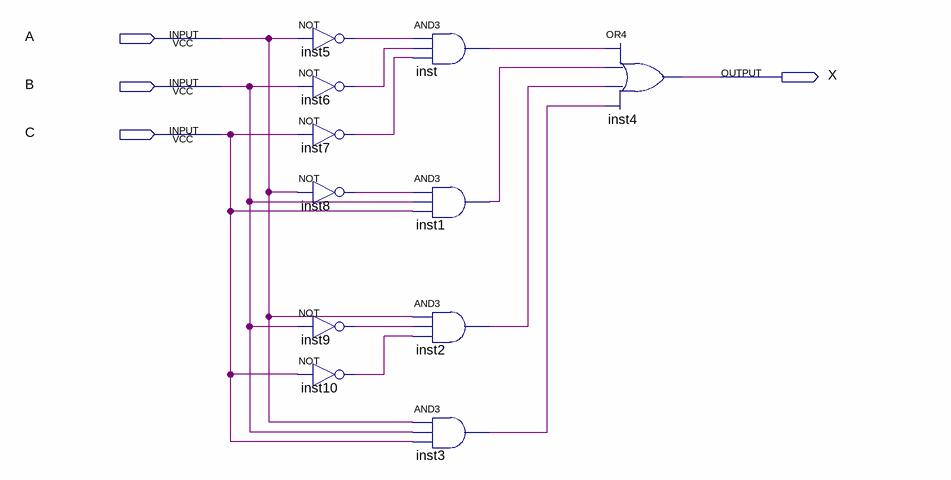
[diagram p0: schematic sheet]
// Quartus schematic CLC.bdf as structural Verilog: 11 symbols, 4 pins
module CLC (
  input  A,
  input  B,
  input  C,
  output X
);

  wire inst1_out, inst2_out, inst3_out, inst5_out, inst6_out, inst7_out, inst8_out, inst9_out, inst10_out,
       inst_out;

  not inst5 (inst5_out, A);
  not inst6 (inst6_out, B);
  not inst7 (inst7_out, C);
  not inst8 (inst8_out, A);
  not inst9 (inst9_out, B);
  not inst10 (inst10_out, C);
  and inst (inst_out, inst5_out, inst6_out, inst7_out);
  and inst1 (inst1_out, inst8_out, B, C);
  and inst2 (inst2_out, A, inst9_out, inst10_out);
  and inst3 (inst3_out, A, B, C);
  or inst4 (X, inst_out, inst1_out, inst2_out, inst3_out);
endmodule
